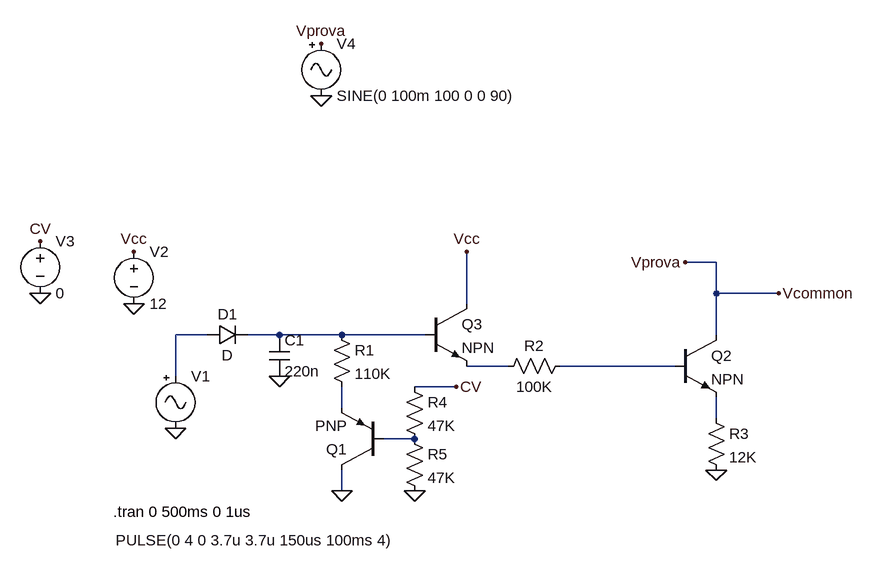
[diagram p0: schematic Pitch envelope.asc]
Pitch envelope.asc, the LTspice schematic file:
Version 4
SHEET 1 1076 680
WIRE 848 -32 800 -32
WIRE 848 16 848 -32
WIRE 944 16 848 16
WIRE 464 32 464 -48
WIRE 64 80 16 80
WIRE 176 80 128 80
WIRE 272 80 176 80
WIRE 400 80 272 80
WIRE 848 80 848 16
WIRE 528 128 464 128
WIRE 784 128 608 128
WIRE 16 144 16 80
WIRE 448 160 384 160
WIRE 272 192 272 160
WIRE 848 208 848 176
WIRE 384 240 336 240
WIRE 272 320 272 288
FLAG 176 144 0
FLAG 272 320 0
FLAG 16 224 0
FLAG -48 32 0
FLAG -48 -48 Vcc
FLAG 464 -48 Vcc
FLAG 848 288 0
FLAG 944 16 Vcommon
FLAG -192 16 0
FLAG -192 -64 CV
FLAG 448 160 CV
FLAG 384 320 0
FLAG 800 -32 Vprova
FLAG 240 -368 Vprova
FLAG 240 -288 0
SYMBOL cap 160 80 R0
SYMATTR InstName C1
SYMATTR Value 220n
SYMBOL res 256 64 R0
SYMATTR InstName R1
SYMATTR Value 110K
SYMBOL Misc\\signal 16 128 R0
WINDOW 3 -92 268 Left 2
WINDOW 123 0 0 Left 0
WINDOW 39 0 0 Left 0
SYMATTR Value PULSE(0 4 0 3.7u 3.7u 150us 100ms 4)
SYMATTR InstName V1
SYMBOL voltage -48 -64 R0
WINDOW 123 0 0 Left 0
WINDOW 39 0 0 Left 0
SYMATTR InstName V2
SYMATTR Value 12
SYMBOL res 624 112 R90
WINDOW 0 0 56 VBottom 2
WINDOW 3 32 56 VTop 2
SYMATTR InstName R2
SYMATTR Value 100K
SYMBOL npn 784 80 R0
SYMATTR InstName Q2
SYMBOL npn 400 32 R0
SYMATTR InstName Q3
SYMBOL res 832 192 R0
SYMATTR InstName R3
SYMATTR Value 12K
SYMBOL diode 64 96 R270
WINDOW 0 32 32 VTop 2
WINDOW 3 0 32 VBottom 2
SYMATTR InstName D1
SYMBOL pnp 336 288 R180
SYMATTR InstName Q1
SYMBOL voltage -192 -80 R0
WINDOW 123 0 0 Left 0
WINDOW 39 0 0 Left 0
SYMATTR InstName V3
SYMATTR Value 0
SYMBOL res 368 144 R0
SYMATTR InstName R4
SYMATTR Value 47K
SYMBOL res 368 224 R0
SYMATTR InstName R5
SYMATTR Value 47K
SYMBOL Misc\\signal 240 -384 R0
WINDOW 123 0 0 Left 0
WINDOW 39 0 0 Left 0
SYMATTR InstName V4
SYMATTR Value SINE(0 100m 100 0 0 90)
TEXT -80 352 Left 2 !.tran 0 500ms 0 1us

The netlist it stands for:
* Pitch envelope.asc
C1 N002 0 220n
R1 N002 N005 110K
V1 N001 0 PULSE(0 4 0 3.7u 3.7u 150us 100ms 4)
V2 Vcc 0 12
R2 N004 N003 100K
Q2 Vprova N004 N006 0 NPN
Q3 Vcc N002 N003 0 NPN
R3 N006 0 12K
D1 N001 N002 D
Q1 0 N007 N005 0 PNP
V3 CV 0 0
R4 CV N007 47K
R5 N007 0 47K
V4 Vprova 0 SINE(0 100m 100 0 0 90)
.model D D
.lib standard.dio
.model NPN NPN
.model PNP PNP
.lib standard.bjt
.tran 0 500ms 0 1us
.backanno
.end